# EAGLE design circuitPendulumLEDsSmall (EAGLE 6.6.0)
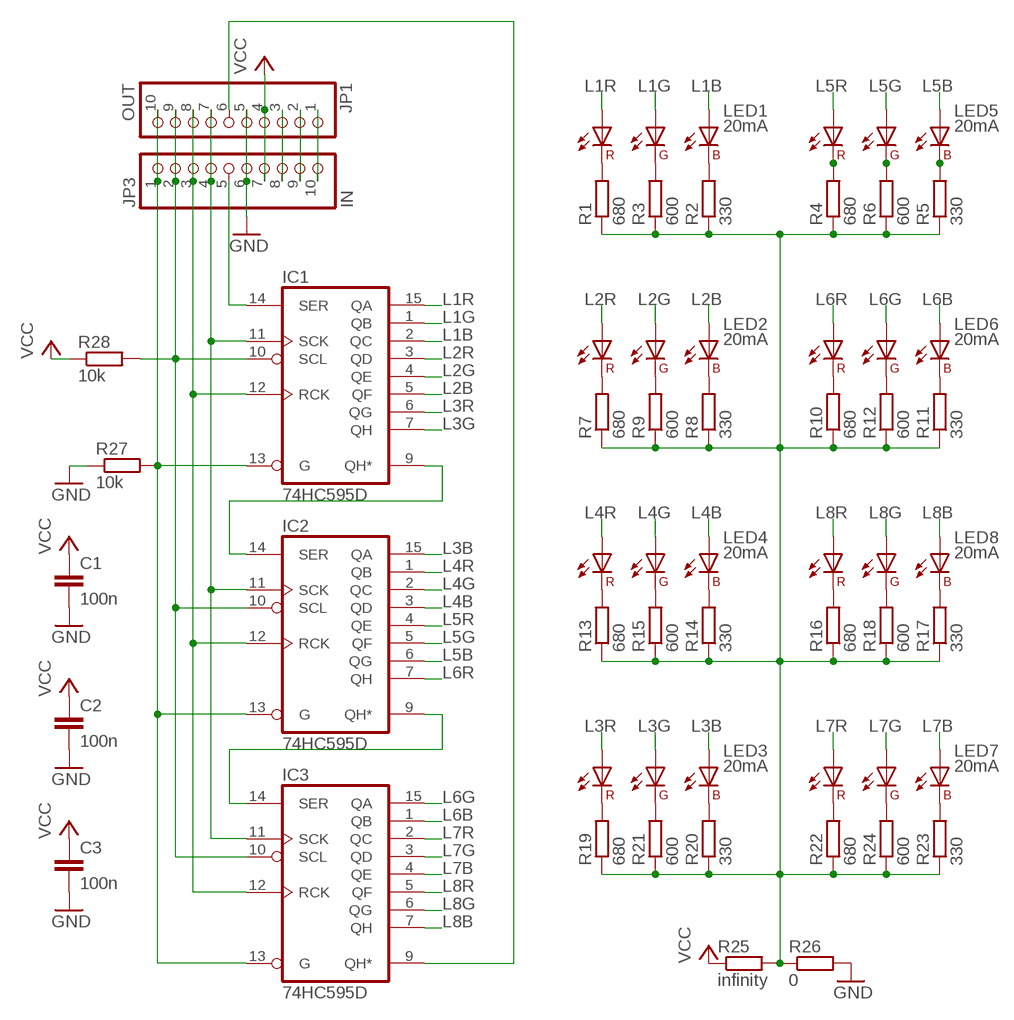
[diagram p0: schematic, sheet 1]

## Parts
C1  100n  C-EUC0603  [C0603]
C2  100n  C-EUC0603  [C0603]
C3  100n  C-EUC0603  [C0603]
IC1  74HC595D  [SO16]
IC2  74HC595D  [SO16]
IC3  74HC595D  [SO16]
JP1  OUT  PINHD-1X10_2.54-SMD-90°  [1X10SMD/90]
JP3  IN  PINHD-1X10_2.54-SMD-90°  [1X10SMD/90]
LED1  20mA  PLCC-6-RGB-SAMSUNG  [PLCC-6_SAMSUNG]
LED2  20mA  PLCC-6-RGB-SAMSUNG  [PLCC-6_SAMSUNG]
LED3  20mA  PLCC-6-RGB-SAMSUNG  [PLCC-6_SAMSUNG]
LED4  20mA  PLCC-6-RGB-SAMSUNG  [PLCC-6_SAMSUNG]
LED5  20mA  PLCC-6-RGB-SAMSUNG  [PLCC-6_SAMSUNG]
LED6  20mA  PLCC-6-RGB-SAMSUNG  [PLCC-6_SAMSUNG]
LED7  20mA  PLCC-6-RGB-SAMSUNG  [PLCC-6_SAMSUNG]
LED8  20mA  PLCC-6-RGB-SAMSUNG  [PLCC-6_SAMSUNG]
R1  680  R-EU_R0603  [R0603]
R2  330  R-EU_R0603  [R0603]
R3  600  R-EU_R0603  [R0603]
R4  680  R-EU_R0603  [R0603]
R5  330  R-EU_R0603  [R0603]
R6  600  R-EU_R0603  [R0603]
R7  680  R-EU_R0603  [R0603]
R8  330  R-EU_R0603  [R0603]
R9  600  R-EU_R0603  [R0603]
R10  680  R-EU_R0603  [R0603]
R11  330  R-EU_R0603  [R0603]
R12  600  R-EU_R0603  [R0603]
R13  680  R-EU_R0603  [R0603]
R14  330  R-EU_R0603  [R0603]
R15  600  R-EU_R0603  [R0603]
R16  680  R-EU_R0603  [R0603]
R17  330  R-EU_R0603  [R0603]
R18  600  R-EU_R0603  [R0603]
R19  680  R-EU_R0603  [R0603]
R20  330  R-EU_R0603  [R0603]
R21  600  R-EU_R0603  [R0603]
R22  680  R-EU_R0603  [R0603]
R23  330  R-EU_R0603  [R0603]
R24  600  R-EU_R0603  [R0603]
R25  infinity  R-EU_R0603  [R0603]
R26  0  R-EU_R0603  [R0603]
R27  10k  R-EU_R0603  [R0603]
R28  10k  R-EU_R0603  [R0603]

## Nets
GND: C1.2 C2.2 C3.2 JP1.5 JP3.6 R26.2 R27.1
L1B: IC1.2(QC) LED1.3(AB)
L1G: IC1.1(QB) LED1.2(AG)
L1R: IC1.15(QA) LED1.1(AR)
L2B: IC1.5(QF) LED2.3(AB)
L2G: IC1.4(QE) LED2.2(AG)
L2R: IC1.3(QD) LED2.1(AR)
L3B: IC2.15(QA) LED3.3(AB)
L3G: IC1.7(QH) LED3.2(AG)
L3R: IC1.6(QG) LED3.1(AR)
L4B: IC2.3(QD) LED4.3(AB)
L4G: IC2.2(QC) LED4.2(AG)
L4R: IC2.1(QB) LED4.1(AR)
L5B: IC2.6(QG) LED5.3(AB)
L5G: IC2.5(QF) LED5.2(AG)
L5R: IC2.4(QE) LED5.1(AR)
L6B: IC3.1(QB) LED6.3(AB)
L6G: IC3.15(QA) LED6.2(AG)
L6R: IC2.7(QH) LED6.1(AR)
L7B: IC3.4(QE) LED7.3(AB)
L7G: IC3.3(QD) LED7.2(AG)
L7R: IC3.2(QC) LED7.1(AR)
L8B: IC3.7(QH) LED8.3(AB)
L8G: IC3.6(QG) LED8.2(AG)
L8R: IC3.5(QF) LED8.1(AR)
N$1: IC1.13(G) IC2.13(G) IC3.13(G) JP1.10 JP3.1 R27.2
N$2: LED1.4(CR) R1.2
N$3: LED1.6(CB) R2.2
N$4: LED1.5(CG) R3.2
N$5: LED5.4(CR) R4.2
N$6: LED5.6(CB) R5.2
N$7: LED5.5(CG) R6.2
N$8: LED4.4(CR) R13.2
N$9: IC1.9(QH*) IC2.14(SER)
N$10: LED4.6(CB) R14.2
N$11: LED4.5(CG) R15.2
N$12: LED8.4(CR) R16.2
N$13: LED8.6(CB) R17.2
N$14: IC1.14(SER) JP3.5
N$15: IC2.9(QH*) IC3.14(SER)
N$16: LED8.5(CG) R18.2
N$17: LED6.4(CR) R10.2
N$18: LED6.6(CB) R11.2
N$19: LED6.5(CG) R12.2
N$20: LED2.4(CR) R7.2
N$21: IC3.9(QH*) JP1.6
N$22: LED2.6(CB) R8.2
N$23: IC1.12(RCK) IC2.12(RCK) IC3.12(RCK) JP1.8 JP3.3
N$24: LED2.5(CG) R9.2
N$25: IC1.11(SCK) IC2.11(SCK) IC3.11(SCK) JP1.7 JP3.4
N$26: LED3.4(CR) R19.2
N$27: LED3.6(CB) R20.2
N$28: LED3.5(CG) R21.2
N$29: LED7.4(CR) R22.2
N$30: LED7.6(CB) R23.2
N$31: LED7.5(CG) R24.2
N$32: JP1.3 JP3.8
N$33: IC1.10(SCL) IC2.10(SCL) IC3.10(SCL) JP1.9 JP3.2 R28.2
N$34: JP1.2 JP3.9
N$35: JP1.1 JP3.10
N$37: R1.1 R2.1 R3.1 R4.1 R5.1 R6.1 R7.1 R8.1 R9.1 R10.1 R11.1 R12.1 R13.1 R14.1 R15.1 R16.1 R17.1 R18.1 R19.1 R20.1 R21.1 R22.1 R23.1 R24.1 R25.2 R26.1
VCC: C1.1 C2.1 C3.1 JP1.4 JP3.7 R25.1 R28.1

## Power pins joined to a net without a drawn wire
GND: IC1.8(GND) IC2.8(GND) IC3.8(GND)
VCC: IC1.16(VCC) IC2.16(VCC) IC3.16(VCC)

## Library data of the parts
C1-C3 = resistor:C-EU: CAPACITOR, European symbol
IC1-IC3 = 74xx-eu:74*595: 8-bit SHIFT REGISTER, output latch
JP1 JP3 = pinhead1:PINHD-1X10: PIN HEADER
LED1-LED8 = LED-Samsung-RGB:PLCC-6-RGB-SAMSUNG
R1-R28 = resistor:R-EU_: RESISTOR, European symbol

## Board
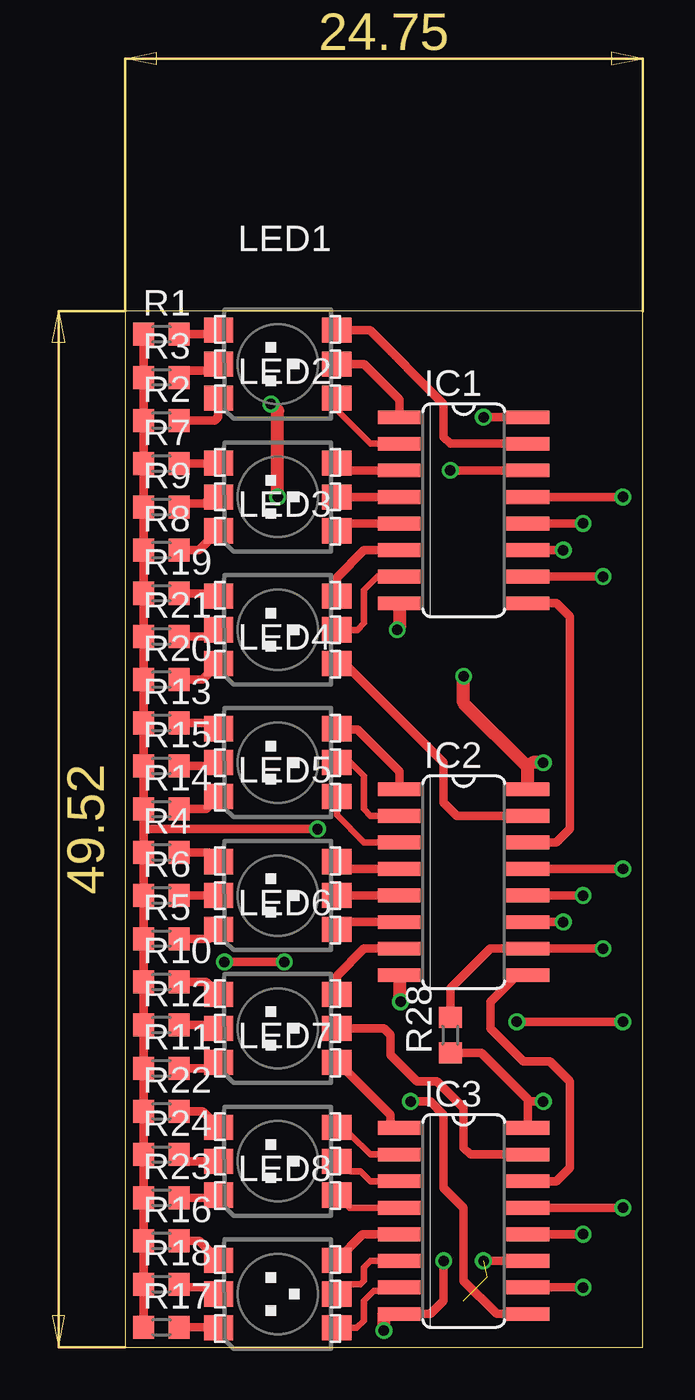
[diagram p1: board, top side]
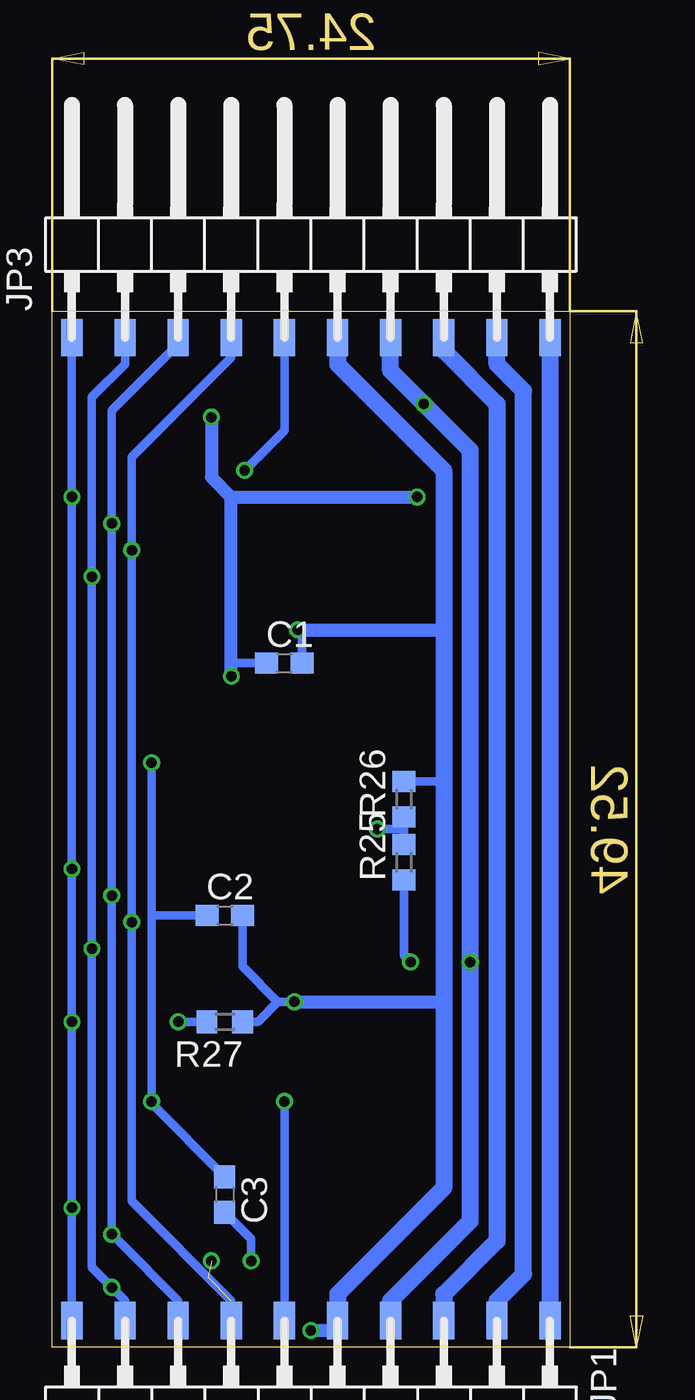
[diagram p2: board, bottom side, seen from below]

Size 24.75 x 49.52 mm. Coordinates in mm from the lower left corner, seen from the top.
Outline: 0,0 24.75,0 24.75,49.52 0,49.52 0,0
Copper layers (1*16): Top 0.035mm / dielectric 1.5mm / Bottom 0.035mm
Design rules "SeeedStudio_2layer_DRU_no_angle_20140221": minimum track width 6mil, minimum drill 12mil, track to track 6mil, track to pad 6mil, pad to pad 6mil, via to via 6mil, smd to smd 0mil, copper to edge 10mil, drill to drill 10mil, minimum pad ring 10mil, minimum via ring 6mil, stop-mask expansion 2mil, vias tented up to drill 100mil, thermal gap 10mil

### Footprints (pad centres in the part's own frame; a part is rotated, then mirrored left to right if it is on the bottom)
C0603 = smd 1.1 x 1: 1 -0.85,0; 2 0.85,0
SO16 = smd 0.66 x 2.032: 1 -4.445,-3.073; 2 -3.175,-3.073; 3 -1.905,-3.073; 4 -0.635,-3.073; 5 0.635,-3.073; 6 1.905,-3.073; 7 3.175,-3.073; 8 4.445,-3.073; 9 4.445,3.073; 10 3.175,3.073; 11 1.905,3.073; 12 0.635,3.073; 13 -0.635,3.073; 14 -1.905,3.073; 15 -3.175,3.073; 16 -4.445,3.073
1X10SMD/90 = smd 1.016 x 1.778: 1 -1.27,-5.08; 2 1.27,-5.08; 3 3.81,-5.08; 4 6.35,-5.08; 5 8.89,-5.08; 6 11.43,-5.08; 7 13.97,-5.08; 8 16.51,-5.08; 9 19.05,-5.08; 10 21.59,-5.08
PLCC-6_SAMSUNG = smd 1.2 x 1.4: 1 -1.619,2.826; 2 0,2.826; 3 1.619,2.826; 4 -1.619,-2.826; 5 0,-2.826; 6 1.619,-2.826
R0603 = smd 1 x 1.1: 1 -0.85,0; 2 0.85,0

### Placement (x,y rotation side)
C1  13.65,32.7 0 bottom
C2  16.51,20.64 0 bottom
C3  16.51,7.3 270 bottom
IC1  16.19,40.01 270 top
IC2  16.19,22.23 270 top
IC3  16.19,6.03 270 top
JP1  2.22,-3.81 180 bottom
JP3  22.54,53.34 0 bottom
LED1  7.3,46.99 270 top
LED2  7.3,40.64 270 top
LED3  7.3,34.29 270 top
LED4  7.3,27.94 270 top
LED5  7.3,21.59 270 top
LED6  7.3,15.24 270 top
LED7  7.3,8.89 270 top
LED8  7.3,2.54 270 top
R1  1.75,48.42 0 top
R2  1.75,44.29 0 top
R3  1.75,46.35 0 top
R4  1.75,23.65 0 top
R5  1.75,19.53 0 top
R6  1.75,21.59 0 top
R7  1.75,42.23 0 top
R8  1.75,38.1 0 top
R9  1.75,40.16 0 top
R10  1.75,17.46 0 top
R11  1.75,13.34 0 top
R12  1.75,15.4 0 top
R13  1.75,29.84 0 top
R14  1.75,25.72 0 top
R15  1.75,27.78 0 top
R16  1.75,5.08 0 top
R17  1.75,0.95 0 top
R18  1.75,3.02 0 top
R19  1.75,36.04 0 top
R20  1.75,31.91 0 top
R21  1.75,33.97 0 top
R22  1.75,11.27 0 top
R23  1.75,7.14 0 top
R24  1.75,9.21 0 top
R25  7.94,23.18 90 bottom
R26  7.94,26.19 90 bottom
R27  16.51,15.56 180 bottom
R28  15.56,14.92 90 top

### Tracks (layer width: path | path; a pad name or v marks a point on that pad's centre or on a via)
GND  (via drill 0.5)
  Top 0.152: IC3.8 13.12,1.37
  Top 0.406: 13.12,34.39 v13.02,34.29 | 13.12,16.57 v13.18,16.51 | 13.12,1.53 IC3.8 | 12.38,1.59 IC3.8 | v15.24,4.13 15.24,2.22 14.61,1.59 IC3.8
  Top 0.61: IC1.8 13.12,34.39 | IC2.8 13.12,16.57 | v12.38,0.79 12.38,1.59
  Bottom 0.406: R26.2 6.09,27.04 6.03,26.99 | v13.18,16.51 13.97,16.51 | 13.97,16.51 14.92,15.56 R27.1 | JP1.5 11.59,0.79 | 13.97,16.51 15.66,18.2 C2.2 | C1.2 12.8,34.08 v13.02,34.29 | C3.2 15.24,5.18 v15.24,4.13
  Bottom 0.61: v13.02,34.29 6.03,34.29 | v13.18,16.51 6.03,16.51 | 11.59,0.79 v12.38,0.79
  Bottom 0.813: JP3.6 11.11,46.99 6.03,41.91 6.03,34.29 6.03,26.99 6.03,16.51 6.03,7.62 11.11,2.54 JP1.5
L1B
  Top 0.305: IC1.2 11.75,43.18 10.13,44.8 LED1.3
L1G
  Top 0.406: 10.58,46.99 LED1.2 11.43,46.99 13.12,45.3 IC1.1
L1R
  Top 0.406: LED1.1 11.72,48.61 15.24,45.09 15.24,43.5 15.56,43.18 IC1.15
L2B
  Top 0.305: 10.48,39.37 LED2.3
  Top 0.406: IC1.5 10.48,39.37
L2G
  Top 0.406: IC1.4 LED2.2
L2R
  Top 0.305: 10.48,41.91 LED2.1
  Top 0.406: IC1.3 10.48,41.91
L3B
  Top 0.406: LED3.3 10.51,32.67 15.24,27.94 15.24,26.04 15.88,25.4 IC2.15
L3G
  Top 0.305: LED3.2 11.11,34.29 11.43,34.61 11.43,36.2 12.06,36.83 IC1.7
L3R
  Top 0.406: IC1.6 11.43,38.1 10.13,36.8 LED3.1
L4B
  Top 0.305: IC2.3 11.43,24.13 10.13,25.43 LED4.3
L4G
  Top 0.305: IC2.2 11.75,25.4 11.43,25.72 11.43,27.3 10.79,27.94 LED4.2
L4R
  Top 0.406: IC2.1 13.12,27.52 11.11,29.53 10.16,29.53 LED4.1
L5B
  Top 0.305: 10.48,20.32 LED5.3
  Top 0.406: IC2.6 10.48,20.32
L5G
  Top 0.406: IC2.5 LED5.2
L5R
  Top 0.305: 10.48,22.86 LED5.1
  Top 0.406: IC2.4 10.48,22.86
L6B
  Top 0.406: 10.13,13.47 LED6.3 10.19,13.62 12.7,11.11 12.7,10.48 IC3.1
L6G
  Top 0.305: 10.79,15.24 LED6.2
  Top 0.406: IC3.15 16.51,9.21 16.19,9.53 16.19,11.43 14.92,12.7 13.97,12.7 12.7,13.97 12.7,14.92 12.38,15.24 10.79,15.24
L6R
  Top 0.406: IC2.7 11.43,19.05 10.13,17.75 LED6.1
L7B
  Top 0.305: IC3.4 10.73,6.67 LED7.3
L7G
  Top 0.305: IC3.3 11.75,7.94 11.27,8.41 10.79,8.41 10.32,8.89 LED7.2
L7R
  Top 0.305: IC3.2 11.75,9.21 10.79,10.16 10.48,10.16
  Top 0.406: 10.48,10.16 LED7.1
L8B
  Top 0.305: LED8.3 11.08,0.92 11.43,1.27 11.43,2.22 11.91,2.7 12.22,2.7 12.38,2.86 IC3.7
L8G
  Top 0.305: IC3.6 11.75,4.13 11.43,3.81 11.43,3.17 11.27,3.02 10.6,3.02 LED8.2
L8R
  Top 0.406: IC3.5 11.37,5.4 LED8.1
N$1  (via drill 0.5)
  Top 0.406: IC1.13 v23.81,40.64 | IC2.13 v23.81,22.86 | v23.81,6.67 IC3.13 | v18.73,15.56 v23.81,15.56
  Bottom 0.406: JP3.1 v23.81,40.64 v23.81,22.86 v23.81,15.56 v23.81,6.67 JP1.10 | R27.2 v18.73,15.56
N$2
  Top 0.406: LED1.4 4.29,48.42 R1.2
N$3
  Top 0.406: R2.2 4.29,44.29 4.45,44.45 4.45,45.34 LED1.6
N$4
  Top 0.406: LED1.5 4.45,46.99 4.13,46.67 2.91,46.67 R3.2
N$5
  Top 0.406: LED5.4 4.03,23.65 R4.2
N$6
  Top 0.406: LED5.6 4.03,19.53 R5.2
N$7
  Top 0.406: LED5.5 R6.2
N$8
  Top 0.406: LED4.4 4.19,29.84 R13.2
N$9
  Top 0.406: IC2.14 20.64,24.13 21.27,24.77 21.27,34.92 20.64,35.56 IC1.9
N$10
  Top 0.406: LED4.6 3.87,25.72 R14.2
N$11
  Top 0.406: LED4.5 4.32,27.78 R15.2
N$12
  Top 0.406: LED8.4 3.56,5.08 R16.2
N$13
  Top 0.406: LED8.6 4.45,0.95 R17.2
N$14  (via drill 0.5)
  Top 0.406: v15.56,41.91 IC1.14
  Bottom 0.406: JP3.5 13.65,43.81 v15.56,41.91
N$15
  Top 0.406: IC3.14 20.64,7.94 21.27,8.57 21.27,12.7 20.32,13.65 19.05,13.65 17.46,15.24 17.46,16.51 18.73,17.78 IC2.9
N$16
  Top 0.406: R18.2 2.7,3.02 2.86,2.86 4.16,2.86 LED8.5
N$17
  Top 0.406: LED6.4 3.87,17.46 R10.2
N$18
  Top 0.406: LED6.6 4.19,13.34 R11.2
N$19
  Top 0.406: LED6.5 4.32,15.4 R12.2
N$20
  Top 0.406: R7.2 4.45,42.23 LED2.4
N$21  (via drill 0.5)
  Top 0.406: v13.65,11.75 14.61,11.75 15.24,11.11 15.24,7.62 16.19,6.67 16.19,3.17 17.78,1.59 IC3.9
  Bottom 0.406: v13.65,11.75 JP1.6
N$22
  Top 0.406: R8.2 3.56,38.1 LED2.6
N$23  (via drill 0.5)
  Top 0.406: v21.91,39.37 IC1.12 | IC2.12 v21.91,21.59 | IC3.12 v21.91,5.4
  Bottom 0.406: JP3.3 18.73,47.94 21.91,44.77 v21.91,39.37 v21.91,21.59 v21.91,5.4 21.59,5.08 18.73,2.22 JP1.8
N$24
  Top 0.406: LED2.5 4.13,40.64 3.81,40.32 2.75,40.32 R9.2
N$25  (via drill 0.5)  (2 unrouted)
  Top 0.406: v20.95,38.1 IC1.11 | IC2.11 v20.95,20.32 | IC3.11 v17.14,4.13
  Bottom 0.406: JP1.7 16.19,2.22 20.95,6.99 v20.95,20.32 v20.95,38.1 20.95,42.55 16.19,47.31 JP3.4
N$26
  Top 0.406: LED3.4 4.35,36.04 R19.2
N$27
  Top 0.406: LED3.6 3.71,31.91 R20.2
N$28
  Top 0.406: LED3.5 4.16,33.97 R21.2
N$29
  Top 0.406: LED7.4 3.71,11.27 R22.2
N$30
  Top 0.406: LED7.6 4.35,7.14 R23.2
N$31
  Top 0.406: LED7.5 2.91,8.89 R24.2
N$32
  Bottom 0.813: JP3.8 6.03,47.62 3.49,45.09 3.49,5.08 6.03,2.54 JP1.3
N$33  (via drill 0.5)
  Top 0.406: v22.86,36.83 IC1.10 | v22.86,19.05 IC2.10 17.46,19.05 15.56,17.14 R28.2 | v21.91,2.86 IC3.10
  Bottom 0.406: JP1.9 21.27,2.22 v21.91,2.86 22.86,3.81 v22.86,19.05 v22.86,36.83 22.86,45.4 21.27,46.99 JP3.2
N$34
  Bottom 0.813: JP1.2 3.49,2.22 2.22,3.49 2.22,45.72 3.49,46.99 JP3.9
N$35
  Bottom 0.813: JP3.10 JP1.1
N$37  (via drill 0.5)
  Top 0.406: R10.1 R12.1 R11.1 R22.1 R24.1 R23.1 R16.1 R18.1 R17.1 0.9,6.03 | R10.1 R5.1 R6.1 R4.1 0.9,24.77 | 0.9,24.77 R14.1 R15.1 R13.1 R20.1 R21.1 R19.1 R8.1 R9.1 R7.1 R2.1 R3.1 R1.1 | R10.1 0.9,18.41 | v9.21,24.77 0.9,24.77
  Bottom 0.406: R25.2 7.94,24.77 | 7.94,24.77 R26.1 7.94,25.4 | 7.94,24.77 v9.21,24.77
VCC  (via drill 0.5)
  Top 0.406: IC1.16 v17.14,44.45 | v7.62,18.41 v4.76,18.41 | 19.48,27.94 19.27,27.72 | 19.27,11.75 19.27,11.85 17.04,14.07 R28.1 | 19.27,11.75 IC3.16 19.37,10.48 | 19.27,11.75 v20,11.75
  Top 0.61: v7.3,40.64 7.3,44.77 v6.99,45.09 | IC2.16 19.27,27.72 16.19,30.8 v16.19,32.07 | v20,27.94 19.48,27.94
  Bottom 0.406: R25.1 7.94,18.73 v7.62,18.41 | 20,20.64 v20,11.75 20,11.64 C3.1 | 20,20.64 v20,27.94 | C2.1 20,20.64 | C1.1 16.19,32.7
  Bottom 0.61: v17.14,44.45 17.14,41.59 16.19,40.64 | 16.19,40.64 v7.3,40.64 | v16.19,32.07 16.19,32.7 16.19,40.64
  Bottom 0.813: JP1.4 8.57,2.22 4.76,6.03 v4.76,18.41 4.76,42.86 v6.99,45.09 8.57,46.67 JP3.7